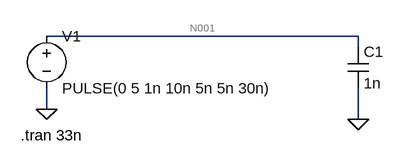
[diagram p0: schematic quiz_q8.asc]
quiz_q8.asc, the LTspice schematic file:
Version 4
SHEET 1 880 680
WIRE 608 80 128 80
WIRE 608 96 608 80
WIRE 128 192 128 160
WIRE 608 208 608 160
FLAG 128 192 0
FLAG 608 208 0
SYMBOL cap 592 96 R0
SYMATTR InstName C1
SYMATTR Value 1n
SYMBOL voltage 128 64 R0
WINDOW 123 0 0 Left 0
WINDOW 39 0 0 Left 0
SYMATTR InstName V1
SYMATTR Value PULSE(0 5 1n 10n 5n 5n 30n)
TEXT 88 232 Left 2 !.tran 33n

The netlist it stands for:
* quiz_q8.asc
C1 N001 0 1n
V1 N001 0 PULSE(0 5 1n 10n 5n 5n 30n)
.tran 33n
.backanno
.end

* Results of the author's LTspice run, read from the files saved beside the schematic
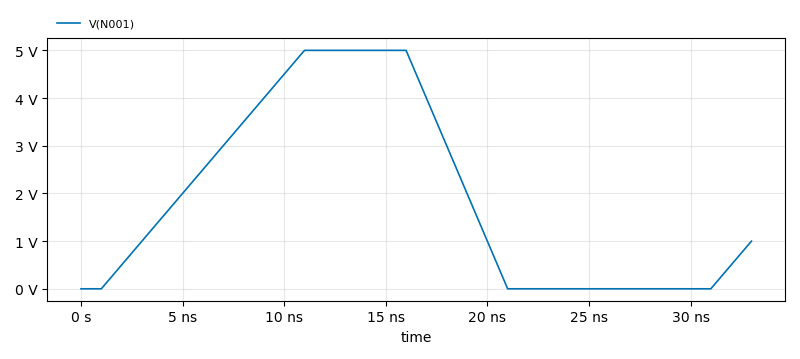
[diagram p1: Transient Analysis of quiz_q8.asc, plotted from the saved traces]
* Transient Analysis, 1 run:
*   V(N001): min 0 V, max 5 V, average 1.924 V, rms 3.081 V, last 1 V